# Altium schematic sheet SATA.schdoc
size A4; CompanyName: Technische Hochschule Nürnberg Georg Simon Ohm; Organization: UltraZohm; Address1: Kesslerplatz 12; Address2: 90489 Nürnberg; Address3: GERMANY; SheetNumber: 34; SheetTotal: 36; Website: www.ultrazohm.com
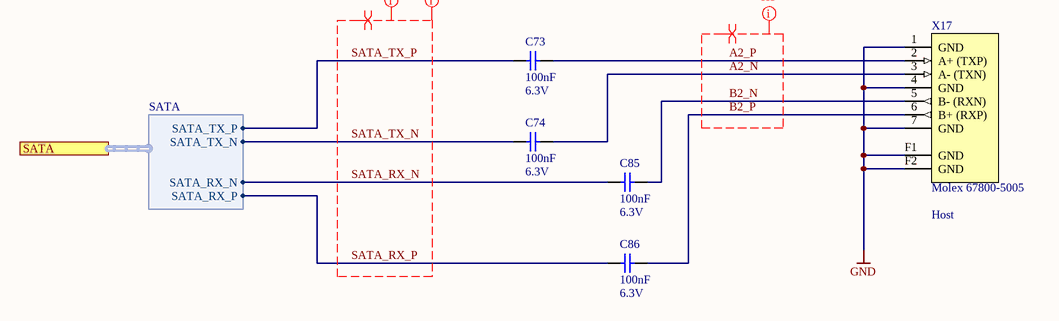
[diagram p0: SATA.schdoc]

## Parts
C73  100nF  Voltage: 6.3V  [CAPC0603X33N_V]
C74  100nF  Voltage: 6.3V  [CAPC0603X33N_V]
C85  100nF  Voltage: 6.3V  [CAPC0603X33N_V]
C86  100nF  Voltage: 6.3V  [CAPC0603X33N_V]
X17  Molex 67800-5005  [67800-5005]

## Ports
SATA (harness SATA)

## Harnesses
SATA: SATA_TX_P, SATA_TX_N, SATA_RX_N, SATA_RX_P

## Nets
GND: X17.1(GND) X17.4(GND) X17.7(GND) X17.F1(GND) X17.F2(GND)
A2_N: C74.2 X17.3(A-_(TXN))
A2_P: C73.2 X17.2(A+_(TXP))
B2_N: C85.2 X17.5(B-_(RXN))
B2_P: C86.2 X17.6(B+_(RXP))
SATA_RX_N: C85.1 ; port SATA.SATA_RX_N
SATA_RX_P: C86.1 ; port SATA.SATA_RX_P
SATA_TX_N: C74.1 ; port SATA.SATA_TX_N
SATA_TX_P: C73.1 ; port SATA.SATA_TX_P

## Layout directives
differential pair: A2_N, A2_P, B2_N, B2_P, SATA_RX_N, SATA_RX_P, SATA_TX_N, SATA_TX_P
net class HS: A2_N, A2_P, B2_N, B2_P, SATA_RX_N, SATA_RX_P, SATA_TX_N, SATA_TX_P
net class SATA: SATA_RX_N, SATA_RX_P, SATA_TX_N, SATA_TX_P

## Notes on the sheet
- (near X17) Host
- Title
- Revision:
- Design Engineer:
- Date:
- Project:
- Sheet
- of

## Library data of the parts
C73 C74 C85 C86 = 24915: KON 100nF 6.3V X5R 10% SMD BF 0603 (0201); AN: 24915; Mixed: SMT; Value: 100n; Preferred: Yes; Temperature-Range: -55/+85; Technology: X5R; Case: 0603 (0201); Tolerance: 10%
X17 = 25614: SATA 7Pol. Connector Vertical; AN: 25614; Mixed: SMT; HelpURL: B:\AD\adlib\datasheet\67800-5005; H-ART: 67800-5005